# EAGLE schematic MorseKOB-Loop-w_PS_v6.eagle (EAGLE 9.5.1)
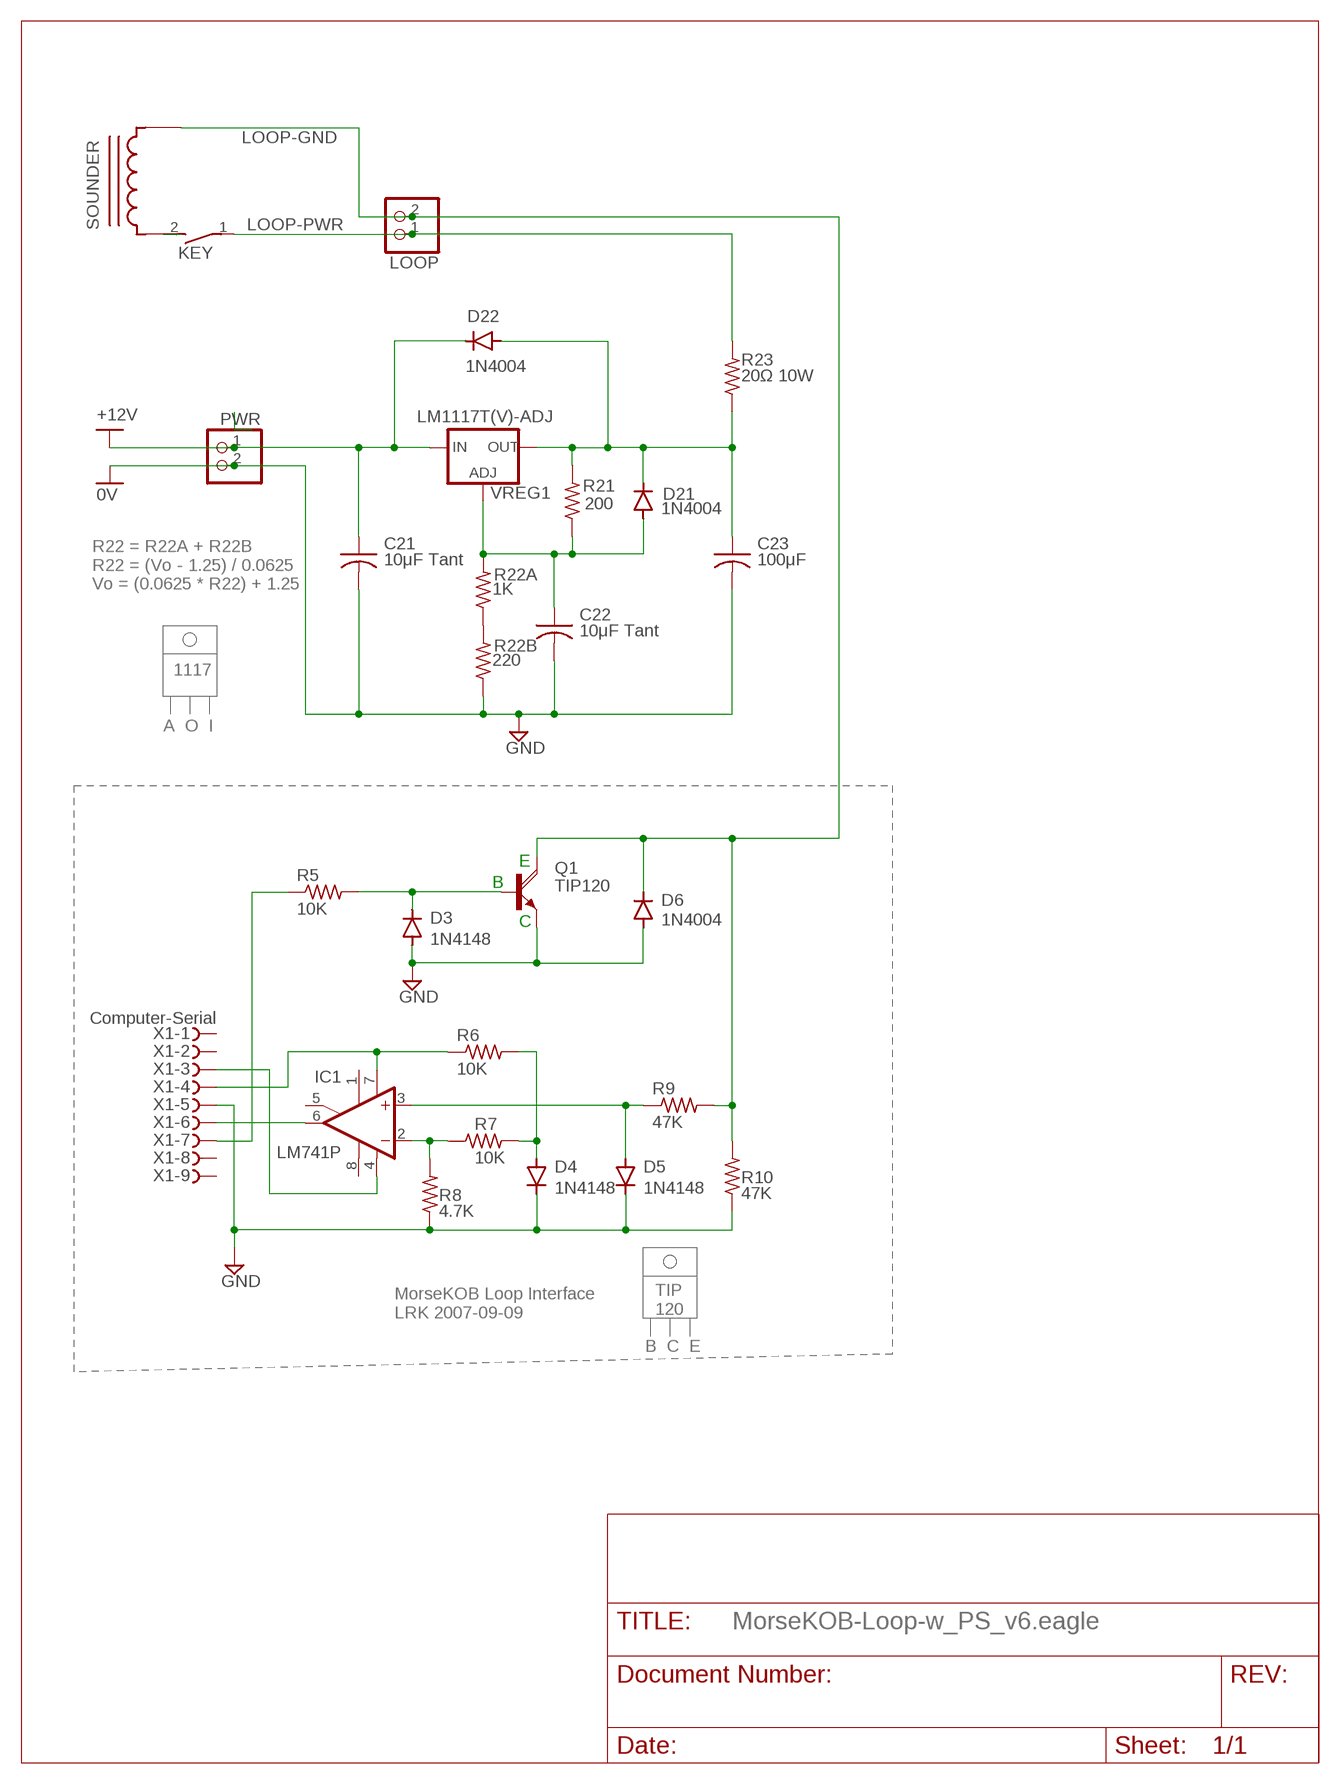
[diagram p0: schematic, sheet 1]

## Parts
C21  10μF Tant  C-US050-075X075  [C050-075X075]
C22  10μF Tant  C-US050-075X075  [C050-075X075]
C23  100μF  C-US025-050X050  [C025-050X050]
D3  1N4148DO35-7  [DO35-7]
D4  1N4148DO35-7  [DO35-7]
D5  1N4148DO35-7  [DO35-7]
D6  1N4004  [DO41-10]
D21  1N4004  [DO-41]
D22  1N4004  [DO-41]
IC1  LM741P  [DIL08]
KEY  DS01E  [DS-01]
LOOP  PINHD-1X2  [1X02]
PWR  PINHD-1X2  [1X02]
Q1  TIP120  [TO220AH]
R5  10K  R-US_0207/10  [0207/10]
R6  10K  R-US_0207/10  [0207/10]
R7  10K  R-US_0207/10  [0207/10]
R8  4.7K  R-US_0207/10  [0207/10]
R9  47K  R-US_0207/10  [0207/10]
R10  47K  R-US_0207/10  [0207/10]
R21  200  R-US_0207/10  [0207/10]
R22A  1K  R-US_0207/10  [0207/10]
R22B  220  R-US_0207/10  [0207/10]
R23  20Ω 10W  R-US_0922/22  [0922/22]
SOUNDER  T37_INDUCTOR  [T37_INDUCTOR]
VREG1  LM1117T(V)-ADJ  [TO220V]
X1  Computer-Serial  F09.590S  [177-009-FEMALE]

## Nets
+V: C21.1 D22.C PWR.1 VREG1.3(IN) ; supply symbol labelled +12V
GND: C21.2 C22.2 C23.2 D3.A D4.C D5.C D6.A PWR.2 Q1.E R8.1 R10.1 R22B.1 X1.5 ; supply symbol labelled 0V
LOOP-GND: D6.C LOOP.2 Q1.C R9.2 R10.2 SOUNDER.CA
LOOP-PWR: KEY.1 LOOP.1 R23.2
N$2: C22.1 D21.A R21.1 R22A.2 VREG1.1(ADJ)
N$3: C23.1 D21.C D22.A R21.2 R23.1 VREG1.2(OUT)
N$4: R22A.1 R22B.2
N$5: IC1.6(OUT) X1.6
N$6: KEY.2 SOUNDER.CB
N$7: IC1.2(-IN) R7.1 R8.2
N$8: D5.A IC1.3(+IN) R9.1
N$9: D4.A R6.2 R7.2
N$10: IC1.7(V+) R6.1 X1.4
N$11: IC1.4(V-) X1.3
N$12: D3.C Q1.B R5.2
N$14: R5.1 X1.7
Unconnected: IC1.1(ON1) IC1.5(ON2) IC1.8(OPT) X1.1 X1.2 X1.8 X1.9

## Notes on the sheet
- R22 = R22A + R22B
  R22 = (Vo - 1.25) / 0.0625
  Vo = (0.0625 * R22) + 1.25
- 1117
  
  
  A  O  I
- E
- B
- C
- MorseKOB Loop Interface
  LRK 2007-09-09
- TIP
    120
  
  B  C  E

## Library data of the parts
C21-C23 = rcl:C-US: CAPACITOR, American symbol; SPICEPREFIX: C
D3-D5 = diode:1N4148: DIODE high speed (Philips); TYPE: 1N4148
D6 = diode:1N4004: DIODE general purpose rectifier, 1 A
D21 D22 = Diodes:1N4004: DIODE GEN PURP 400V 1A DO41 Manufacturer's datasheet <https://www.mccsemi.com/pdf/Products/1N4001-1N4007(DO-41).pdf>; CREATED_BY: PCBLayout.com; DIGIKEY_PART_NUMBER: 1N4004MSCT-ND; MANUFACTURER: Micro Commercial Co; MPN: 1N4004; PACKAGE: DO-41
IC1 = linear:*741: OP AMP
KEY = Switch:DS01E: DIL/CODE SWITCH; CATEGORY: SWITCH; TYPE: SPST
LOOP PWR = Connector:PINHD-1X2: PIN HEADER; CATEGORY: CONNECTOR; SUB-CATEGORY: PIN-HEADER
Q1 = transistor-power:TIP120: NPN DARLINGTON TRANSISTOR
R5-R10 R21 R22A R22B R23 = rcl:R-US_: RESISTOR, American symbol; SPICEPREFIX: R
SOUNDER = inductrs-xformrs-toroid:T37_INDUCTOR: Inductor wound on a T37 Toroid
VREG1 = lm1117_11:LM1117?-ADJ: 800mA Low-Dropout Linear Regulator Source: http://www.ti.com/lit/ds/symlink/lm1117-n.pdf; MF: Texas Instruments; MPN: LM1777T-ADJ; OC_FARNELL: 9485805; OC_NEWARK: 13B5345
X1 = con-subd:F09?S: SUB-D; OC_FARNELL: unknown; OC_NEWARK: unknown